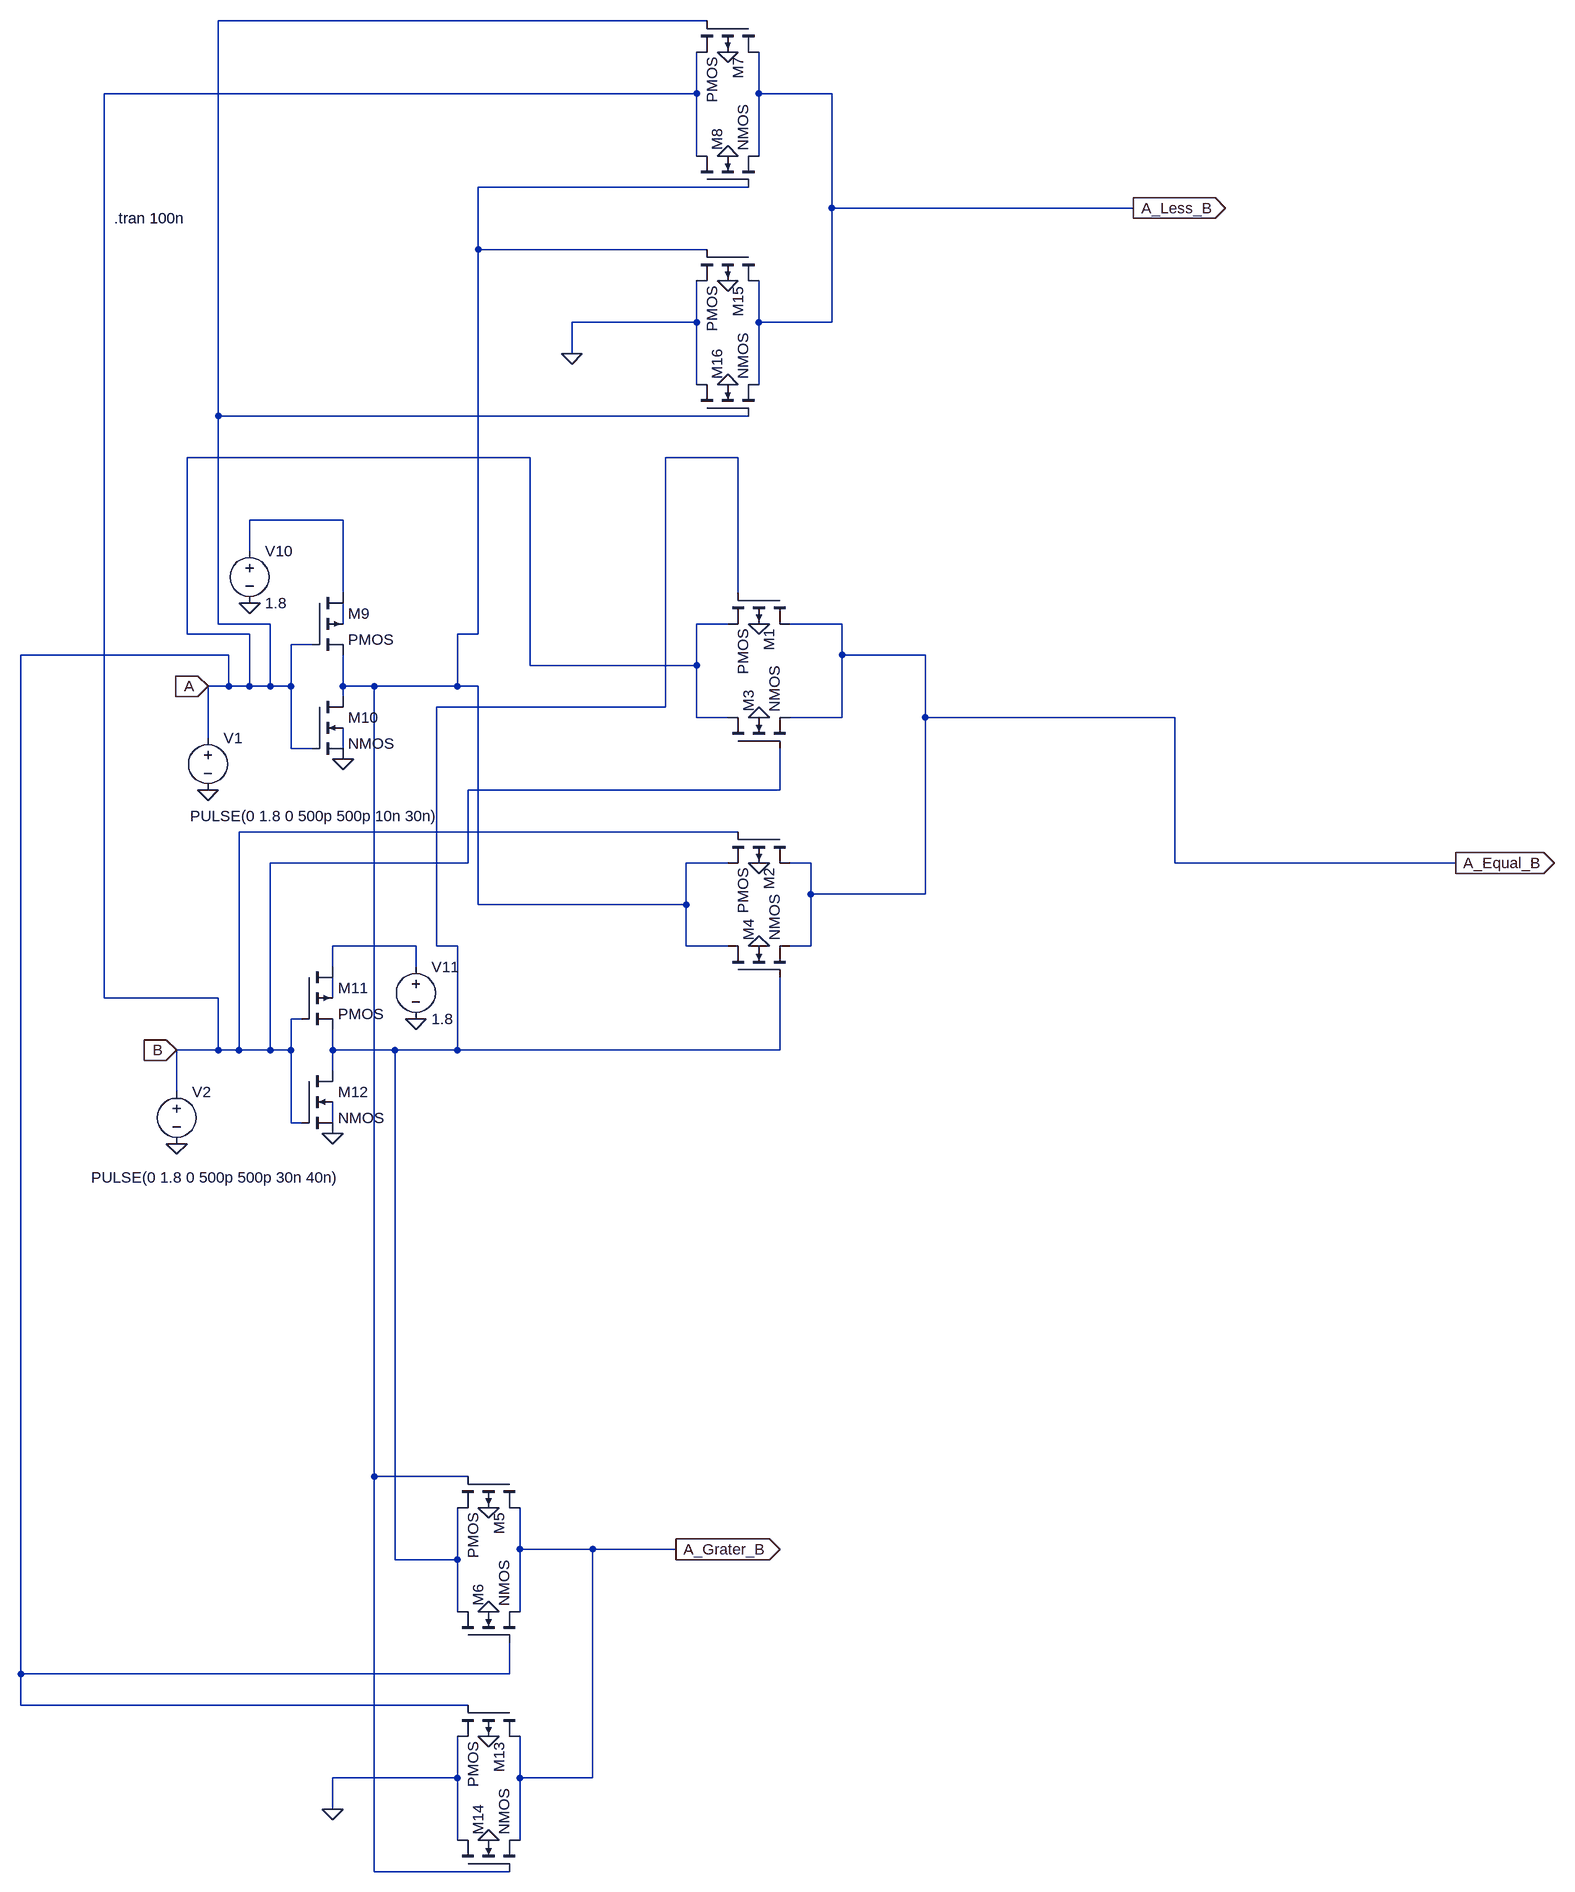
[diagram p0: schematic Comparator.asc]
Comparator.asc, the LTspice schematic file:
Version 4
SHEET 1 1784 1880
WIRE 160 -976 -592 -976
WIRE 144 -864 144 -928
WIRE 144 -864 -768 -864
WIRE 240 -864 240 -928
WIRE 352 -864 240 -864
WIRE 144 -768 144 -864
WIRE 240 -768 240 -864
WIRE 224 -720 -192 -720
WIRE 352 -688 352 -864
WIRE 816 -688 352 -688
WIRE -192 -624 -192 -720
WIRE 160 -624 -192 -624
WIRE 144 -512 144 -576
WIRE 144 -512 -48 -512
WIRE 240 -512 240 -576
WIRE 352 -512 352 -688
WIRE 352 -512 240 -512
WIRE -48 -464 -48 -512
WIRE 144 -416 144 -512
WIRE 240 -416 240 -512
WIRE -592 -368 -592 -976
WIRE 224 -368 -592 -368
WIRE -112 -304 -640 -304
WIRE 208 -304 96 -304
WIRE -400 -208 -544 -208
WIRE -544 -160 -544 -208
WIRE -400 -96 -400 -208
WIRE 208 -96 208 -304
WIRE -592 -48 -592 -368
WIRE -512 -48 -592 -48
WIRE -400 -48 -400 -80
WIRE 192 -48 144 -48
WIRE 368 -48 288 -48
WIRE -640 -32 -640 -304
WIRE -544 -32 -640 -32
WIRE -192 -32 -192 -624
WIRE -192 -32 -224 -32
WIRE -448 -16 -480 -16
WIRE -576 0 -896 0
WIRE 368 0 368 -48
WIRE 496 0 368 0
WIRE -112 16 -112 -304
WIRE 144 16 144 -48
WIRE 144 16 -112 16
WIRE -576 48 -576 0
WIRE -576 48 -608 48
WIRE -544 48 -544 -32
WIRE -544 48 -576 48
WIRE -512 48 -512 -48
WIRE -512 48 -544 48
WIRE -480 48 -480 -16
WIRE -480 48 -512 48
WIRE -400 48 -400 0
WIRE -352 48 -400 48
WIRE -224 48 -224 -32
WIRE -224 48 -352 48
WIRE -192 48 -224 48
WIRE -400 64 -400 48
WIRE 96 80 96 -304
WIRE 96 80 -256 80
WIRE 144 96 144 16
WIRE 192 96 144 96
WIRE 368 96 368 0
WIRE 368 96 288 96
WIRE 496 96 496 0
WIRE 880 96 496 96
WIRE -608 128 -608 48
WIRE -480 144 -480 48
WIRE -448 144 -480 144
WIRE -400 144 -400 112
WIRE 272 208 272 144
WIRE 272 208 -208 208
WIRE 208 272 -560 272
WIRE -208 320 -208 208
WIRE -208 320 -512 320
WIRE 192 320 128 320
WIRE 320 320 288 320
WIRE 880 320 880 96
WIRE 1312 320 880 320
WIRE 320 368 320 320
WIRE 496 368 496 96
WIRE 496 368 320 368
WIRE -192 384 -192 48
WIRE 128 384 128 320
WIRE 128 384 -192 384
WIRE -288 448 -416 448
WIRE -256 448 -256 80
WIRE -224 448 -256 448
WIRE 128 448 128 384
WIRE 192 448 128 448
WIRE 320 448 320 368
WIRE 320 448 288 448
WIRE -416 480 -416 448
WIRE -288 480 -288 448
WIRE -768 528 -768 -864
WIRE -592 528 -768 528
WIRE -416 528 -416 496
WIRE -464 560 -480 560
WIRE -592 608 -592 528
WIRE -592 608 -656 608
WIRE -560 608 -560 272
WIRE -560 608 -592 608
WIRE -512 608 -512 320
WIRE -512 608 -560 608
WIRE -480 608 -480 560
WIRE -480 608 -512 608
WIRE -416 608 -416 576
WIRE -320 608 -416 608
WIRE -224 608 -224 448
WIRE -224 608 -320 608
WIRE 272 608 272 496
WIRE 272 608 -224 608
WIRE -416 640 -416 608
WIRE -656 672 -656 608
WIRE -480 720 -480 608
WIRE -464 720 -480 720
WIRE -416 720 -416 688
WIRE -352 1264 -352 48
WIRE -208 1264 -352 1264
WIRE -128 1376 -128 1312
WIRE -16 1376 -128 1376
WIRE 112 1376 -16 1376
WIRE -320 1392 -320 608
WIRE -224 1392 -224 1312
WIRE -224 1392 -320 1392
WIRE -224 1472 -224 1392
WIRE -128 1472 -128 1376
WIRE -896 1568 -896 0
WIRE -144 1568 -144 1520
WIRE -144 1568 -896 1568
WIRE -896 1616 -896 1568
WIRE -208 1616 -896 1616
WIRE -224 1728 -224 1664
WIRE -224 1728 -416 1728
WIRE -128 1728 -128 1664
WIRE -16 1728 -16 1376
WIRE -16 1728 -128 1728
WIRE -416 1776 -416 1728
WIRE -224 1824 -224 1728
WIRE -128 1824 -128 1728
WIRE -352 1872 -352 1264
WIRE -144 1872 -352 1872
FLAG -416 736 0
FLAG -400 160 0
FLAG -608 208 0
FLAG -656 752 0
FLAG -608 48 A
IOPIN -608 48 In
FLAG -656 608 B
IOPIN -656 608 In
FLAG 816 -688 A_Less_B
IOPIN 816 -688 Out
FLAG -544 -80 0
FLAG -288 560 0
FLAG 112 1376 A_Grater_B
IOPIN 112 1376 Out
FLAG 1312 320 A_Equal_B
IOPIN 1312 320 Out
FLAG -416 1776 0
FLAG -48 -464 0
FLAG 192 -928 0
FLAG 192 -768 0
FLAG 192 -576 0
FLAG 192 -416 0
FLAG -176 1824 0
FLAG -176 1664 0
FLAG -176 1472 0
FLAG -176 1312 0
FLAG 240 -48 0
FLAG 240 96 0
FLAG 240 320 0
FLAG 240 448 0
SYMBOL pmos4 -448 -96 R0
SYMATTR InstName M9
SYMBOL nmos4 -448 64 R0
SYMATTR InstName M10
SYMBOL pmos4 -464 480 R0
SYMATTR InstName M11
SYMBOL nmos4 -464 640 R0
SYMATTR InstName M12
SYMBOL voltage -608 112 R0
WINDOW 3 -27 136 Left 2
WINDOW 123 0 0 Left 0
WINDOW 39 0 0 Left 0
SYMATTR Value PULSE(0 1.8 0 500p 500p 10n 30n)
SYMATTR InstName V1
SYMBOL voltage -656 656 R0
WINDOW 3 -132 148 Left 2
WINDOW 123 0 0 Left 0
WINDOW 39 0 0 Left 0
SYMATTR Value PULSE(0 1.8 0 500p 500p 30n 40n)
SYMATTR InstName V2
SYMBOL voltage -544 -176 R0
WINDOW 123 0 0 Left 0
WINDOW 39 0 0 Left 0
SYMATTR InstName V10
SYMATTR Value 1.8
SYMBOL voltage -288 464 R0
WINDOW 123 0 0 Left 0
WINDOW 39 0 0 Left 0
SYMATTR InstName V11
SYMATTR Value 1.8
SYMBOL pmos4 288 -96 R90
SYMATTR InstName M1
SYMBOL pmos4 288 272 R90
SYMATTR InstName M2
SYMBOL nmos4 192 144 R270
SYMATTR InstName M3
SYMBOL nmos4 192 496 R270
SYMATTR InstName M4
SYMBOL pmos4 -128 1264 R90
SYMATTR InstName M5
SYMBOL nmos4 -224 1520 R270
SYMATTR InstName M6
SYMBOL pmos4 -128 1616 R90
SYMATTR InstName M13
SYMBOL nmos4 -224 1872 R270
SYMATTR InstName M14
SYMBOL pmos4 240 -976 R90
SYMATTR InstName M7
SYMBOL nmos4 144 -720 R270
SYMATTR InstName M8
SYMBOL pmos4 240 -624 R90
SYMATTR InstName M15
SYMBOL nmos4 144 -368 R270
SYMATTR InstName M16
TEXT -752 -672 Left 2 !.tran 100n

The netlist it stands for:
* Comparator.asc
M9 N003 A N001 N004 PMOS
M10 N001 A 0 N005 NMOS
M11 N006 B N002 N007 PMOS
M12 N002 B 0 N008 NMOS
V1 A 0 PULSE(0 1.8 0 500p 500p 10n 30n)
V2 B 0 PULSE(0 1.8 0 500p 500p 30n 40n)
V10 N003 0 1.8
V11 N006 0 1.8
M1 A_Equal_B N002 A 0 PMOS
M2 A_Equal_B B N001 0 PMOS
M3 A B A_Equal_B 0 NMOS
M4 N001 N002 A_Equal_B 0 NMOS
M5 A_Grater_B N001 N002 0 PMOS
M6 N002 A A_Grater_B 0 NMOS
M13 A_Grater_B A 0 0 PMOS
M14 0 N001 A_Grater_B 0 NMOS
M7 A_Less_B A B 0 PMOS
M8 B N001 A_Less_B 0 NMOS
M15 A_Less_B N001 0 0 PMOS
M16 0 A A_Less_B 0 NMOS
.model NMOS NMOS
.model PMOS PMOS
.lib standard.mos
.tran 100n
.backanno
.end